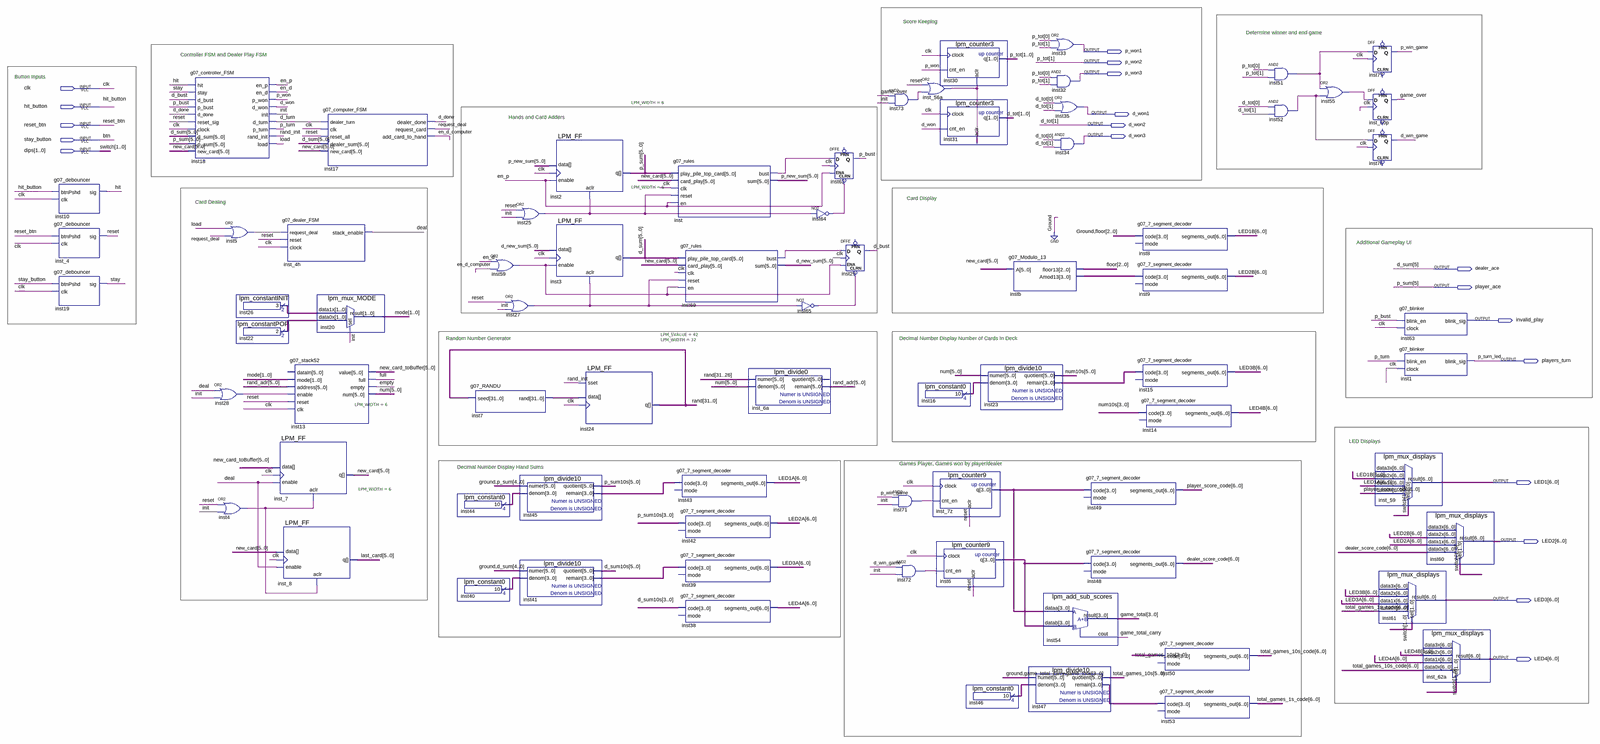
[diagram p0: schematic sheet, whole]
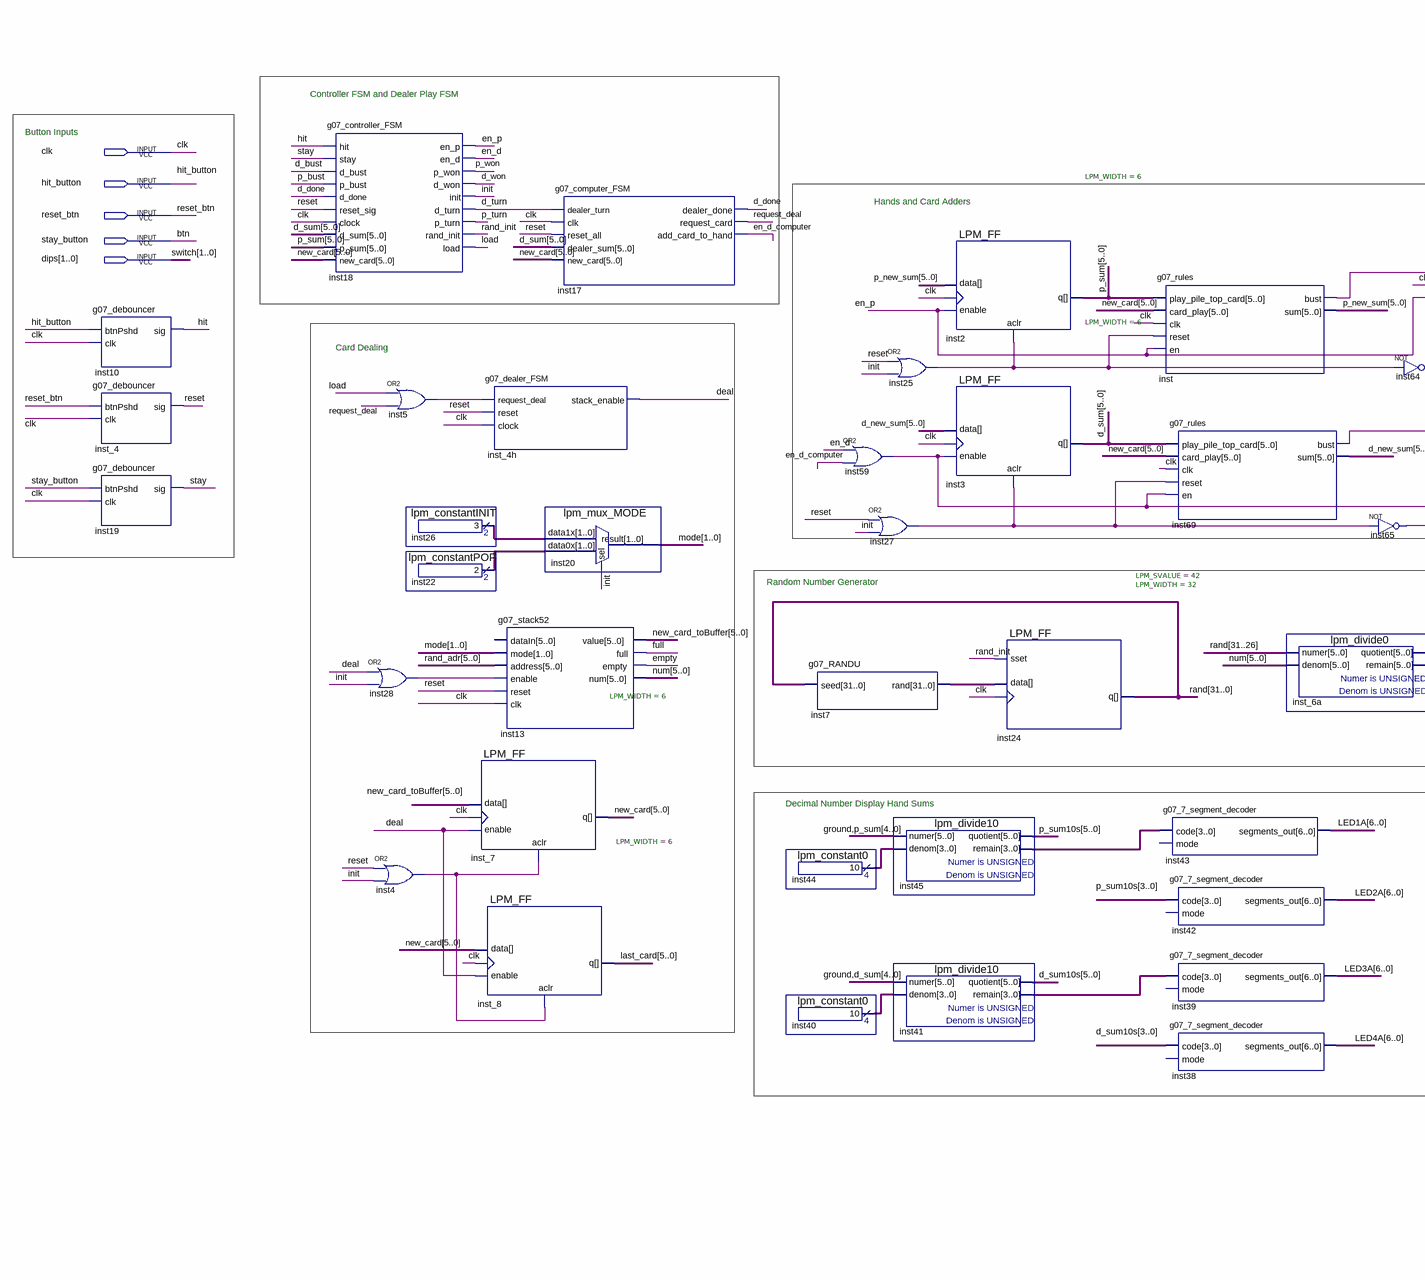
[diagram p1: schematic sheet, left part]
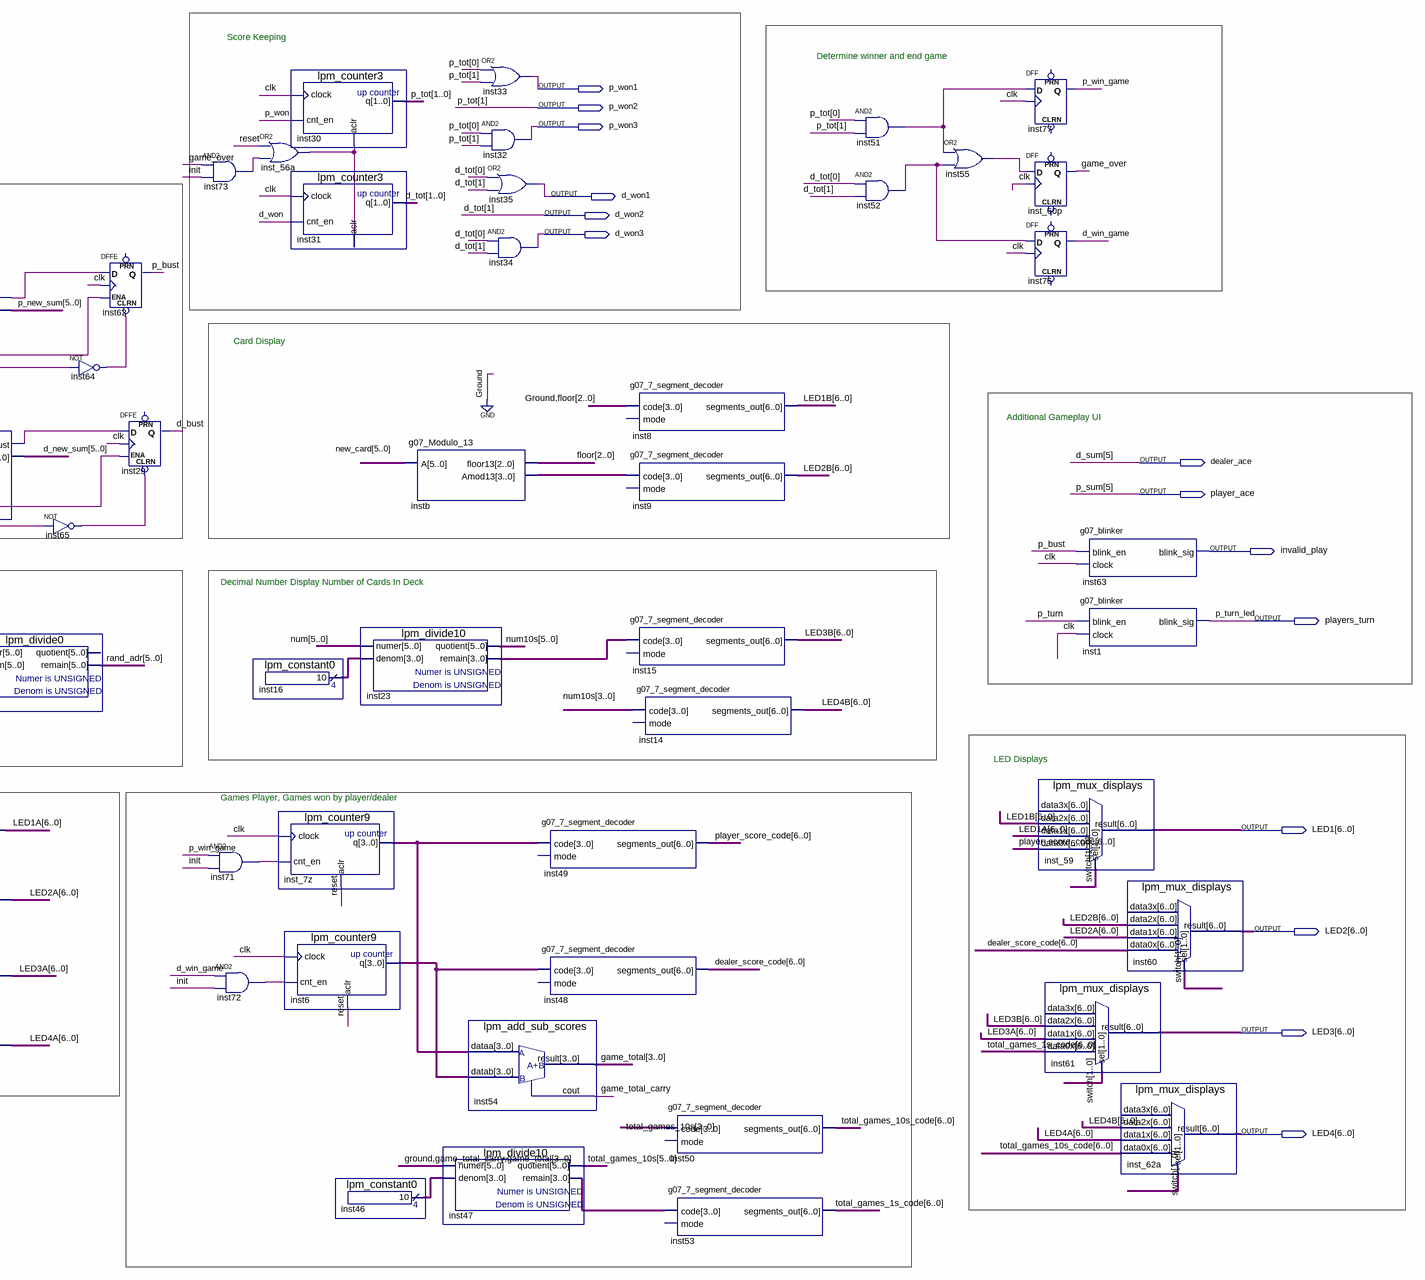
[diagram p2: schematic sheet, right part]
// Quartus schematic g07_lab5_testbed.bdf as structural Verilog: 75 symbols, 19 pins
module g07_lab5_testbed (
  input  clk,
  input  hit_button,
  input  reset_btn,
  input  stay_button,
  input  [1:0] dips,
  output p_won1,
  output p_won2,
  output p_won3,
  output d_won1,
  output d_won2,
  output d_won3,
  output dealer_ace,
  output player_ace,
  output invalid_play,
  output players_turn,
  output [6:0] LED1,
  output [6:0] LED2,
  output [6:0] LED3,
  output [6:0] LED4
);

  wire d_bust, d_done, d_turn, d_win_game, d_won, deal, empty, en_d, en_d_computer, en_p, full, game_over,
       game_total_carry, hit, init, inst4_out, inst5_out, inst25_out, inst27_out, inst28_out, inst51_out,
       inst52_out, inst55_out, inst59_out, inst64_out, inst65_out, inst69_bust, inst71_out, inst72_out,
       inst73_out, inst_56a_out, inst_bust, load, p_bust, p_turn, p_win_game, p_won, rand_init, request_deal,
       reset, stay;
  wire [0:0] d_tot, p_tot;
  wire [1:0] inst22_result, inst26_result, mode;
  wire [2:0] floor;
  wire [3:0] game_total, inst6_q, inst16_result, inst23_remain, inst40_result, inst41_remain, inst44_result,
       inst45_remain, inst46_result, inst47_remain, inst_7z_q, instb_amod13;
  wire [4:0] d_sum, p_sum;
  wire [5:0] d_new_sum, d_sum10s, last_card, new_card, new_card_toBuffer, num, num10s, p_new_sum, p_sum10s,
       rand_adr, total_games_10s;
  wire [6:0] dealer_score_code, LED1A, LED1B, LED2A, LED2B, LED3A, LED3B, LED4A, LED4B, player_score_code,
       total_games_1s_code, total_games_10s_code;
  wire [31:0] inst7_rand, \rand ;

  g07_debouncer inst10 (.btnPshd(hit_button), .clk(clk), .sig(hit));
  g07_debouncer inst_4 (.btnPshd(reset_btn), .clk(clk), .sig(reset));
  g07_debouncer inst19 (.btnPshd(stay_button), .clk(clk), .sig(stay));
  g07_controller_FSM inst18 (
    .hit(hit), .stay(stay), .d_bust(d_bust), .p_bust(p_bust), .d_done(d_done), .reset_sig(reset),
    .clock(clk), .d_sum({dealer_ace, d_sum}), .p_sum({player_ace, p_sum}), .new_card(new_card), .en_p(en_p),
    .en_d(en_d), .p_won(p_won), .d_won(d_won), .init(init), .d_turn(d_turn), .p_turn(p_turn),
    .rand_init(rand_init), .load(load));
  or inst5 (inst5_out, load, request_deal);
  or inst28 (inst28_out, deal, init);
  or inst4 (inst4_out, reset, init);
  lpm_constantINIT inst26 (.result(inst26_result));
  lpm_constantPOP inst22 (.result(inst22_result));
  g07_dealer_FSM inst_4h (.request_deal(inst5_out), .reset(reset), .clock(clk), .stack_enable(deal));
  g07_stack52 inst13 (
    .mode(mode), .address(rand_adr), .enable(inst28_out), .reset(reset), .clk(clk),
    .value(new_card_toBuffer), .full(full), .empty(empty), .num(num));  // open: dataIn
  LPM_FF #(.LPM_WIDTH(6)) inst_7 (.aclr(inst4_out), .clock(clk), .data(new_card_toBuffer), .enable(deal), .q(new_card));
  LPM_FF #(.LPM_WIDTH(6)) inst_8 (.aclr(inst4_out), .clock(clk), .data(new_card), .enable(deal), .q(last_card));
  g07_computer_FSM inst17 (
    .dealer_turn(d_turn), .clk(clk), .reset_all(reset), .dealer_sum({dealer_ace, d_sum}),
    .new_card(new_card), .dealer_done(d_done), .request_card(request_deal), .add_card_to_hand(en_d_computer));
  lpm_mux_MODE inst20 (.data1x(inst26_result), .data0x(inst22_result), .sel(init), .result(mode));
  g07_RANDU inst7 (.seed(\rand ), .\rand (inst7_rand));
  lpm_constant0 inst44 (.result(inst44_result));
  lpm_constant0 inst40 (.result(inst40_result));
  or inst59 (inst59_out, en_d, en_d_computer);
  or inst25 (inst25_out, reset, init);
  or inst27 (inst27_out, reset, init);
  lpm_divide10 inst45 (.numer({1'b0, p_sum}), .denom(inst44_result), .quotient(p_sum10s), .remain(inst45_remain));
  lpm_divide10 inst41 (.numer({1'b0, d_sum}), .denom(inst40_result), .quotient(d_sum10s), .remain(inst41_remain));
  LPM_FF #(.LPM_WIDTH(6)) inst2 (
    .aclr(inst25_out), .clock(clk), .data(p_new_sum), .enable(en_p), .q({player_ace, p_sum}));
  LPM_FF #(.LPM_WIDTH(6)) inst3 (
    .aclr(inst27_out), .clock(clk), .data(d_new_sum), .enable(inst59_out), .q({dealer_ace, d_sum}));
  LPM_FF #(.LPM_SVALUE(42), .LPM_WIDTH(32)) inst24 (.clock(clk), .data(inst7_rand), .sset(rand_init), .q(\rand ));
  g07_rules inst (
    .play_pile_top_card({player_ace, p_sum}), .card_play(new_card), .clk(clk), .reset(inst25_out), .en(en_p),
    .bust(inst_bust), .sum(p_new_sum));
  g07_7_segment_decoder inst43 (.code(inst45_remain), .segments_out(LED1A));  // open: mode
  g07_rules inst69 (
    .play_pile_top_card({dealer_ace, d_sum}), .card_play(new_card), .clk(clk), .reset(inst27_out),
    .en(inst59_out), .bust(inst69_bust), .sum(d_new_sum));
  g07_7_segment_decoder inst42 (.code(p_sum10s[3:0]), .segments_out(LED2A));  // open: mode
  g07_7_segment_decoder inst39 (.code(inst41_remain), .segments_out(LED3A));  // open: mode
  g07_7_segment_decoder inst38 (.code(d_sum10s[3:0]), .segments_out(LED4A));  // open: mode
  lpm_divide0 inst_6a (.numer(\rand [31:26]), .denom(num), .remain(rand_adr));  // open: quotient
  not inst64 (inst64_out, inst25_out);
  not inst65 (inst65_out, inst27_out);
  DFFE inst62 (.CLRN(inst64_out), .D(inst_bust), .CLK(clk), .ENA(en_p), .Q(p_bust));  // open: PRN
  DFFE inst29 (.CLRN(inst65_out), .D(inst69_bust), .CLK(clk), .ENA(inst59_out), .Q(d_bust));  // open: PRN
  and inst73 (inst73_out, game_over, init);
  and inst71 (inst71_out, p_win_game, init);
  and inst72 (inst72_out, d_win_game, init);
  lpm_counter3 inst30 (.clock(clk), .cnt_en(p_won), .aclr(inst_56a_out), .q({p_won2, p_tot[0]}));
  or inst_56a (inst_56a_out, reset, inst73_out);
  lpm_counter3 inst31 (.clock(clk), .cnt_en(d_won), .aclr(inst_56a_out), .q({d_won2, d_tot[0]}));
  lpm_constant0 inst16 (.result(inst16_result));
  lpm_counter9 inst_7z (.clock(clk), .cnt_en(inst71_out), .aclr(reset), .q(inst_7z_q));
  lpm_counter9 inst6 (.clock(clk), .cnt_en(inst72_out), .aclr(reset), .q(inst6_q));
  lpm_constant0 inst46 (.result(inst46_result));
  lpm_divide10 inst23 (.numer(num), .denom(inst16_result), .quotient(num10s), .remain(inst23_remain));
  g07_Modulo_13 instb (.A(new_card), .floor13(floor), .Amod13(instb_amod13));
  lpm_divide10 inst47 (
    .numer({1'b0, game_total_carry, game_total}), .denom(inst46_result), .quotient(total_games_10s),
    .remain(inst47_remain));
  or inst33 (p_won1, p_tot[0], p_won2);
  and inst32 (p_won3, p_tot[0], p_won2);
  or inst35 (d_won1, d_tot[0], d_won2);
  and inst34 (d_won3, d_tot[0], d_won2);
  lpm_add_sub_scores inst54 (.dataa(inst_7z_q), .datab(inst6_q), .result(game_total), .cout(game_total_carry));
  g07_7_segment_decoder inst49 (.code(inst_7z_q), .segments_out(player_score_code));  // open: mode
  g07_7_segment_decoder inst48 (.code(inst6_q), .segments_out(dealer_score_code));  // open: mode
  g07_7_segment_decoder inst8 (.code({1'b0, floor}), .segments_out(LED1B));  // open: mode
  g07_7_segment_decoder inst9 (.code(instb_amod13), .segments_out(LED2B));  // open: mode
  g07_7_segment_decoder inst15 (.code(inst23_remain), .segments_out(LED3B));  // open: mode
  g07_7_segment_decoder inst14 (.code(num10s[3:0]), .segments_out(LED4B));  // open: mode
  g07_7_segment_decoder inst50 (.code(total_games_10s[3:0]), .segments_out(total_games_10s_code));  // open: mode
  g07_7_segment_decoder inst53 (.code(inst47_remain), .segments_out(total_games_1s_code));  // open: mode
  and inst51 (inst51_out, p_tot[0], p_won2);
  and inst52 (inst52_out, d_tot[0], d_won2);
  or inst55 (inst55_out, inst51_out, inst52_out);
  DFF inst77 (.CLK(clk), .D(inst51_out), .Q(p_win_game));  // open: CLRN, PRN
  DFF inst_60p (.CLK(clk), .D(inst55_out), .Q(game_over));  // open: CLRN, PRN
  DFF inst76 (.CLK(clk), .D(inst52_out), .Q(d_win_game));  // open: CLRN, PRN
  lpm_mux_displays inst_59 (
    .data2x(LED1B), .data1x(LED1A), .data0x(player_score_code), .sel(dips), .result(LED1));  // open: data3x
  lpm_mux_displays inst61 (
    .data2x(LED3B), .data1x(LED3A), .data0x(total_games_1s_code), .sel(dips), .result(LED3));  // open: data3x
  g07_blinker inst63 (.blink_en(p_bust), .clock(clk), .blink_sig(invalid_play));
  g07_blinker inst1 (.blink_en(p_turn), .clock(clk), .blink_sig(players_turn));
  lpm_mux_displays inst60 (
    .data2x(LED2B), .data1x(LED2A), .data0x(dealer_score_code), .sel(dips), .result(LED2));  // open: data3x
  lpm_mux_displays inst_62a (
    .data2x(LED4B), .data1x(LED4A), .data0x(total_games_10s_code), .sel(dips), .result(LED4));  // open: data3x

  // Other names for the same wires on the sheet: btn = stay_button; d_sum[5] = dealer_ace; d_tot[1] = d_won2;
  //   p_sum[5] = player_ace; p_tot[1] = p_won2; p_turn_led = players_turn; switch[1:0] = dips

  // Notes on the sheet:
  //   Score Keeping
  //   Determine winner and end game
  //   Controller FSM and Dealer Play FSM
  //   Button Inputs
  //   Hands and Card Adders
  //   Card Display
  //   Card Dealing
  //   Additional Gameplay UI
  //   Random Number Generator
  //   Decimal Number Display Number of Cards In Deck
  //   LED Displays
  //   Games Player, Games won by player/dealer
  //   Decimal Number Display Hand Sums
endmodule
